# EAGLE design powerTestv1-0 (EAGLE 6.2)
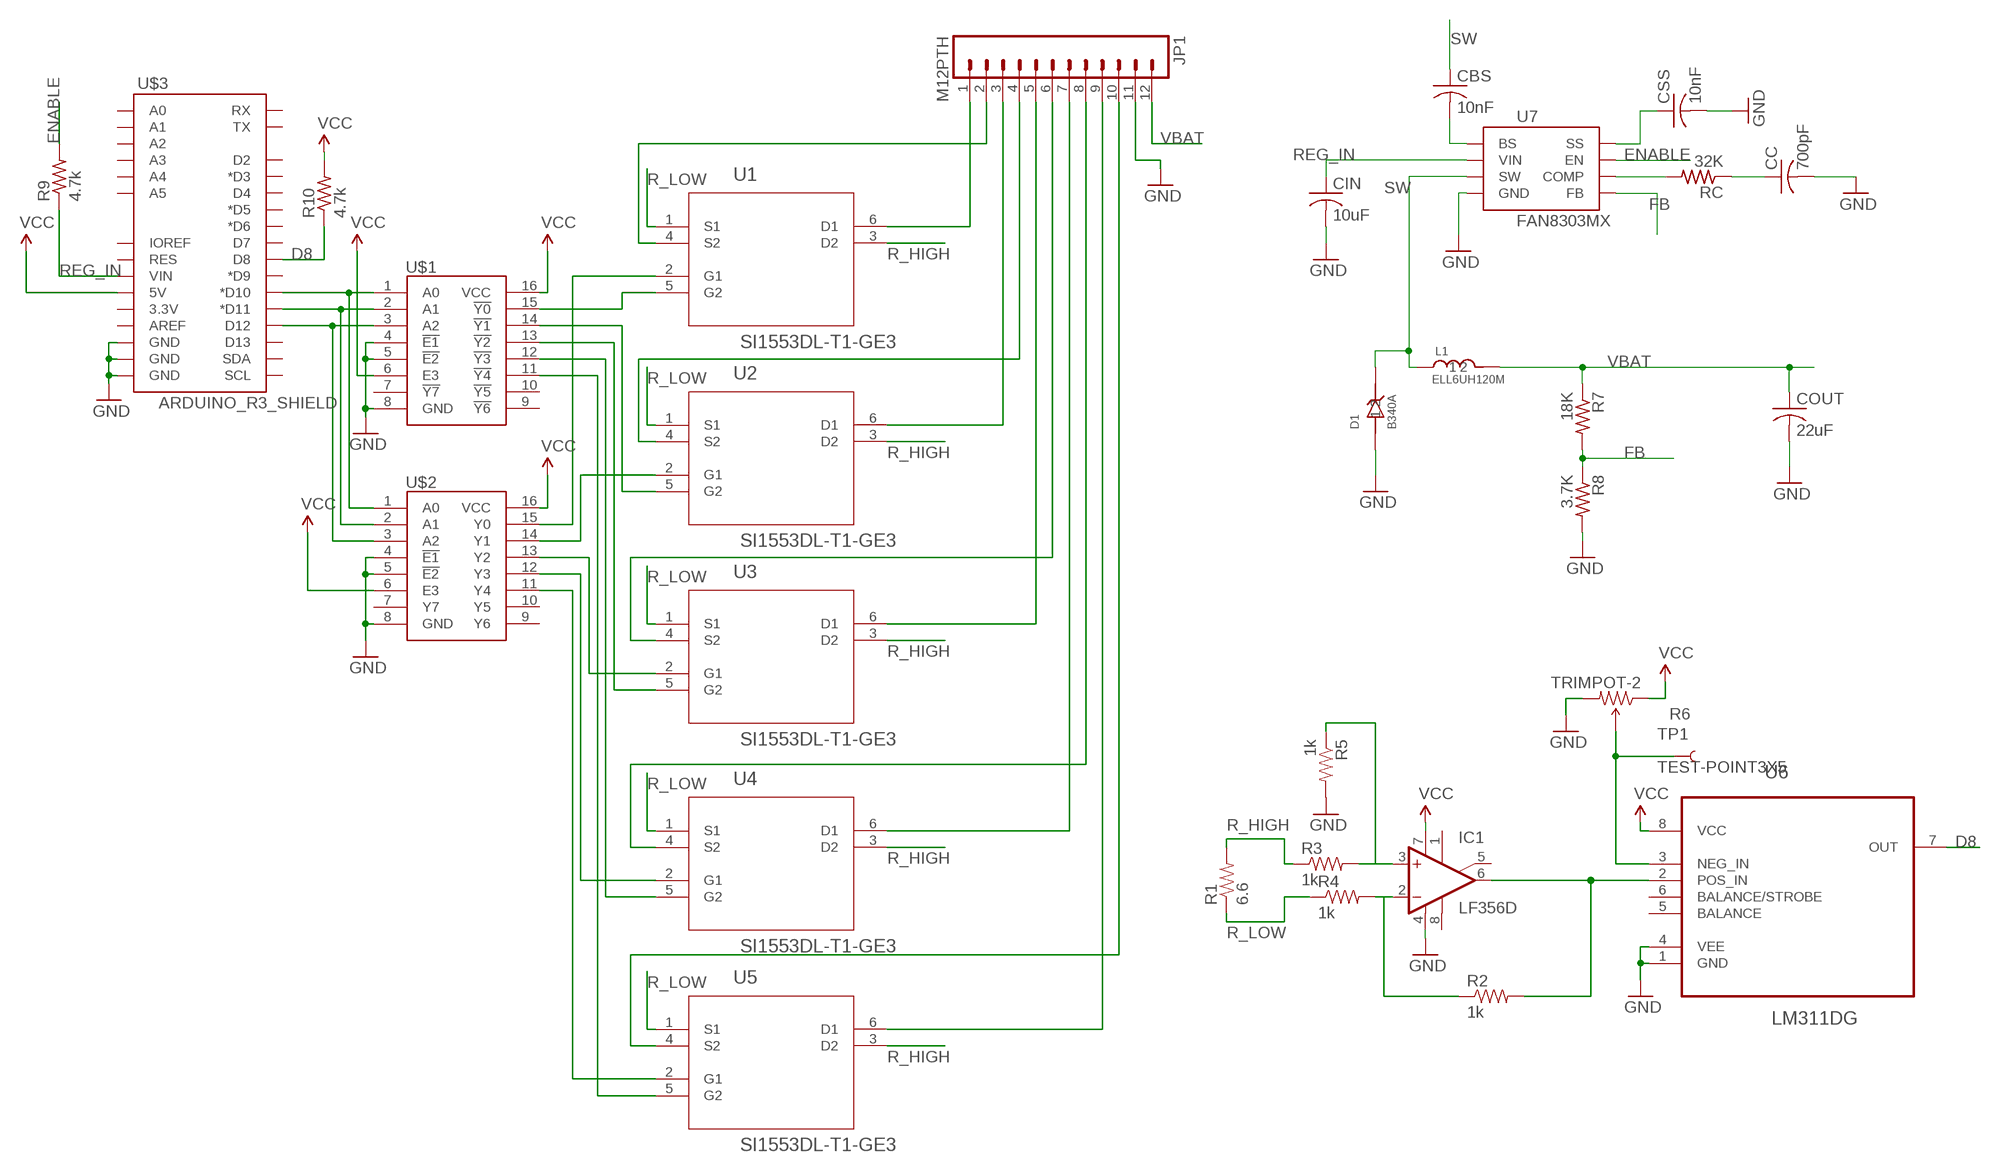
[diagram p0: schematic, sheet 1]

## Parts
CBS  10nF  C-USC0603  [C0603]
CC  700pF  C-USC0603  [C0603]
CIN  10uF  C-USC0603  [C0603]
COUT  22uF  C-USC0603  [C0603]
CSS  10nF  C-USC0603  [C0603]
D1  B340A  [B340A]
IC1  LF356D  [SO08]
JP1  M12PTH  [1X12]
L1  ELL6UH120M  [ELL6UH120M]
R1  6.6  RESISTORPTH-2W  [AXIAL-0.8]
R2  1k  RESISTOR0603-RES  [0603-RES]
R3  1k  RESISTOR0603-RES  [0603-RES]
R4  1k  RESISTOR0603-RES  [0603-RES]
R5  1k  RESISTOR0603-RES  [0603-RES]
R6  TRIMPOT-2  [TRIMPOT_TC33]
R7  18K  R-US_R0603  [R0603]
R8  3.7K  R-US_R0603  [R0603]
R9  4.7k  R-US_R0603  [R0603]
R10  4.7k  R-US_R0603  [R0603]
RC  32K  R-US_R0603  [R0603]
TP1  TEST-POINT3X5  [PAD.03X.05]
U1  SI1553DL-T1-GE3  [SOT65P210X110-6N]
U2  SI1553DL-T1-GE3  [SOT65P210X110-6N]
U3  SI1553DL-T1-GE3  [SOT65P210X110-6N]
U4  SI1553DL-T1-GE3  [SOT65P210X110-6N]
U5  SI1553DL-T1-GE3  [SOT65P210X110-6N]
U6  LM311DG  [SOIC127P600X175-8N]
U7  FAN8303MX  [FAN8303MX]
U$1  74HC138SO16  [SO16]
U$2  74HC238SO16  [SO16]
U$3  ARDUINO_R3_SHIELD  [UNO_R3_SHIELD]

## Nets
D8: R10.1 U6.7(OUT) U$3.D8
ENABLE: R9.2 U7.P$7(EN)
FB: R7.2 R8.1 U7.P$5(FB)
GND [power]: CC.2 CIN.2 COUT.2 CSS.2 D1.P$1 IC1.4(V-) JP1.11 R5.2 R6.3(CW) R8.2 U6.1(GND) U6.4(VEE) U7.P$4(GND) U$1.4(!E1) U$1.5(!E2) U$1.8(GND) U$2.4(!E1) U$2.5(!E2) U$2.8(GND) U$3.GND@0(GND) U$3.GND@1(GND) U$3.GND@2(GND)
N$1: U$1.1(A0) U$2.1(A0) U$3.D10(*D10)
N$2: U$1.2(A1) U$2.2(A1) U$3.D11(*D11)
N$3: U$1.3(A2) U$2.3(A2) U$3.D12
N$4: U1.5(G2) U$1.15(!Y0)
N$5: U2.5(G2) U$1.14(!Y1)
N$6: U3.5(G2) U$1.13(!Y2)
N$7: U4.5(G2) U$1.12(!Y3)
N$8: U5.5(G2) U$1.11(!Y4)
N$9: U1.2(G1) U$2.15(Y0)
N$10: U2.2(G1) U$2.14(Y1)
N$11: U3.2(G1) U$2.13(Y2)
N$12: U4.2(G1) U$2.12(Y3)
N$13: U5.2(G1) U$2.11(Y4)
N$14 [high_i]: JP1.1 U1.6(D1)
N$15 [high_i]: JP1.3 U2.6(D1)
N$16 [high_i]: JP1.5 U3.6(D1)
N$17 [high_i]: JP1.7 U4.6(D1)
N$18 [high_i]: JP1.9 U5.6(D1)
N$19 [high_i]: JP1.2 U1.4(S2)
N$20: IC1.2(-IN) R2.1 R4.2
N$21: IC1.6(OUT) R2.2 U6.2(POS_IN)
N$22 [high_i]: JP1.4 U2.4(S2)
N$23 [high_i]: JP1.6 U3.4(S2)
N$24 [high_i]: JP1.8 U4.4(S2)
N$25: IC1.3(+IN) R3.2 R5.1
N$26: R6.2(WIPER) TP1.P$1 U6.3(NEG_IN)
N$27: CSS.1 U7.P$8(SS)
N$28: CBS.2 U7.P$1(BS)
N$29: RC.2 U7.P$6(COMP)
N$30: CC.1 RC.1
N$31 [high_i]: JP1.10 U5.4(S2)
R_HIGH [high_i]: R1.P$2 R3.1 U1.3(D2) U2.3(D2) U3.3(D2) U4.3(D2) U5.3(D2)
R_LOW [high_i]: R1.P$1 R4.1 U1.1(S1) U2.1(S1) U3.1(S1) U4.1(S1) U5.1(S1)
REG_IN: CIN.1 R9.1 U7.P$2(VIN) U$3.VIN
SW: CBS.1 D1.P$2 L1.P$1 U7.P$3(SW)
VBAT: COUT.1 JP1.12 L1.P$2 R7.1
VCC: IC1.7(V+) R6.1(CCW) R10.2 U6.8(VCC) U$1.6(E3) U$1.16(VCC) U$2.6(E3) U$2.16(VCC) U$3.5V
Unconnected: IC1.1(ON1) IC1.5(ON2) IC1.8(OPT) U6.5(BALANCE) U6.6(BALANCE/STROBE) U$1.7(!Y7) U$1.9(!Y6) U$1.10(!Y5) U$2.7(Y7) U$2.9(Y6) U$2.10(Y5) U$3.3.3V U$3.A0 U$3.A1 U$3.A2 U$3.A3 U$3.A4 U$3.A5 U$3.AREF U$3.D2 U$3.D3(*D3) U$3.D4 U$3.D5(*D5) U$3.D6(*D6) U$3.D7 U$3.D9(*D9) U$3.D13 U$3.IOREF U$3.RES U$3.RX U$3.SCL U$3.SDA U$3.TX

## Library data of the parts
CBS CC CIN COUT CSS = rcl:C-US: CAPACITOR, American symbol
D1 = roblocks:B340A
IC1 = linear:LF356: OP AMP
JP1 = SparkFun-Connectors:M12: Header 12 Standard 12-pin 0.1" header. Use with straight break away headers (SKU : PRT-00116), right angle break away headers (PRT-00553), swiss pins (PRT-00743), machine pins (PRT-00117), and female headers (PRT-00115).
L1 = roblocks:ELL6UH120M
R1 = SparkFun-Resistors:RESISTOR: Resistor Basic schematic elements and footprints for 0603, 1206, and PTH resistors.
R2-R5 = SparkFun-Passives:RESISTOR: Resistor Basic schematic elements and footprints for 0603, 1206, and PTH resistors.
R6 = SparkFun-Electromechanical:TRIMPOT: Various small potentiometers for "set-and-forget" applications
R7-R10 RC = rcl:R-US_: RESISTOR, American symbol
TP1 = SparkFun-Passives:TEST-POINT: Bare copper test points for troubleshooting or ICT
U1-U5 = Vishay_By_element14_Batch_1:SI1553DL-T1-GE3: Complementary 2.5 V (G-S) MOSFET; MPN: SI1553DL-T1-GE3; OC_FARNELL: 2056713; OC_NEWARK: 64T4055; PACKAGE: SOT363-6; SUPPLIER: VISHAY SILICONIX
U6 = ON Semiconductor_By_element14_Batch_1:LM311DG: Single Comparators; MPN: LM311DG; OC_FARNELL: 1468705; OC_NEWARK: 98H0570; PACKAGE: SOIC-8; SUPPLIER: Onsemiconductor
U7 = roblocks:FAN8303MX
U$1 = nxp:74HC138
U$2 = nxp:74HC238
U$3 = SparkFun-Boards:ARDUINO_R3_SHIELD: Shield form compatible with the Arduino Uno R3.

## Net classes
0 signal: width 0.305 mm, drill 0.305 mm, clearance 0.152 mm
1 power: width 0.381 mm, drill 0.305 mm, clearance 0.152 mm
2 high_i: width 0.381 mm, drill 0.305 mm, clearance 0.152 mm

## Board
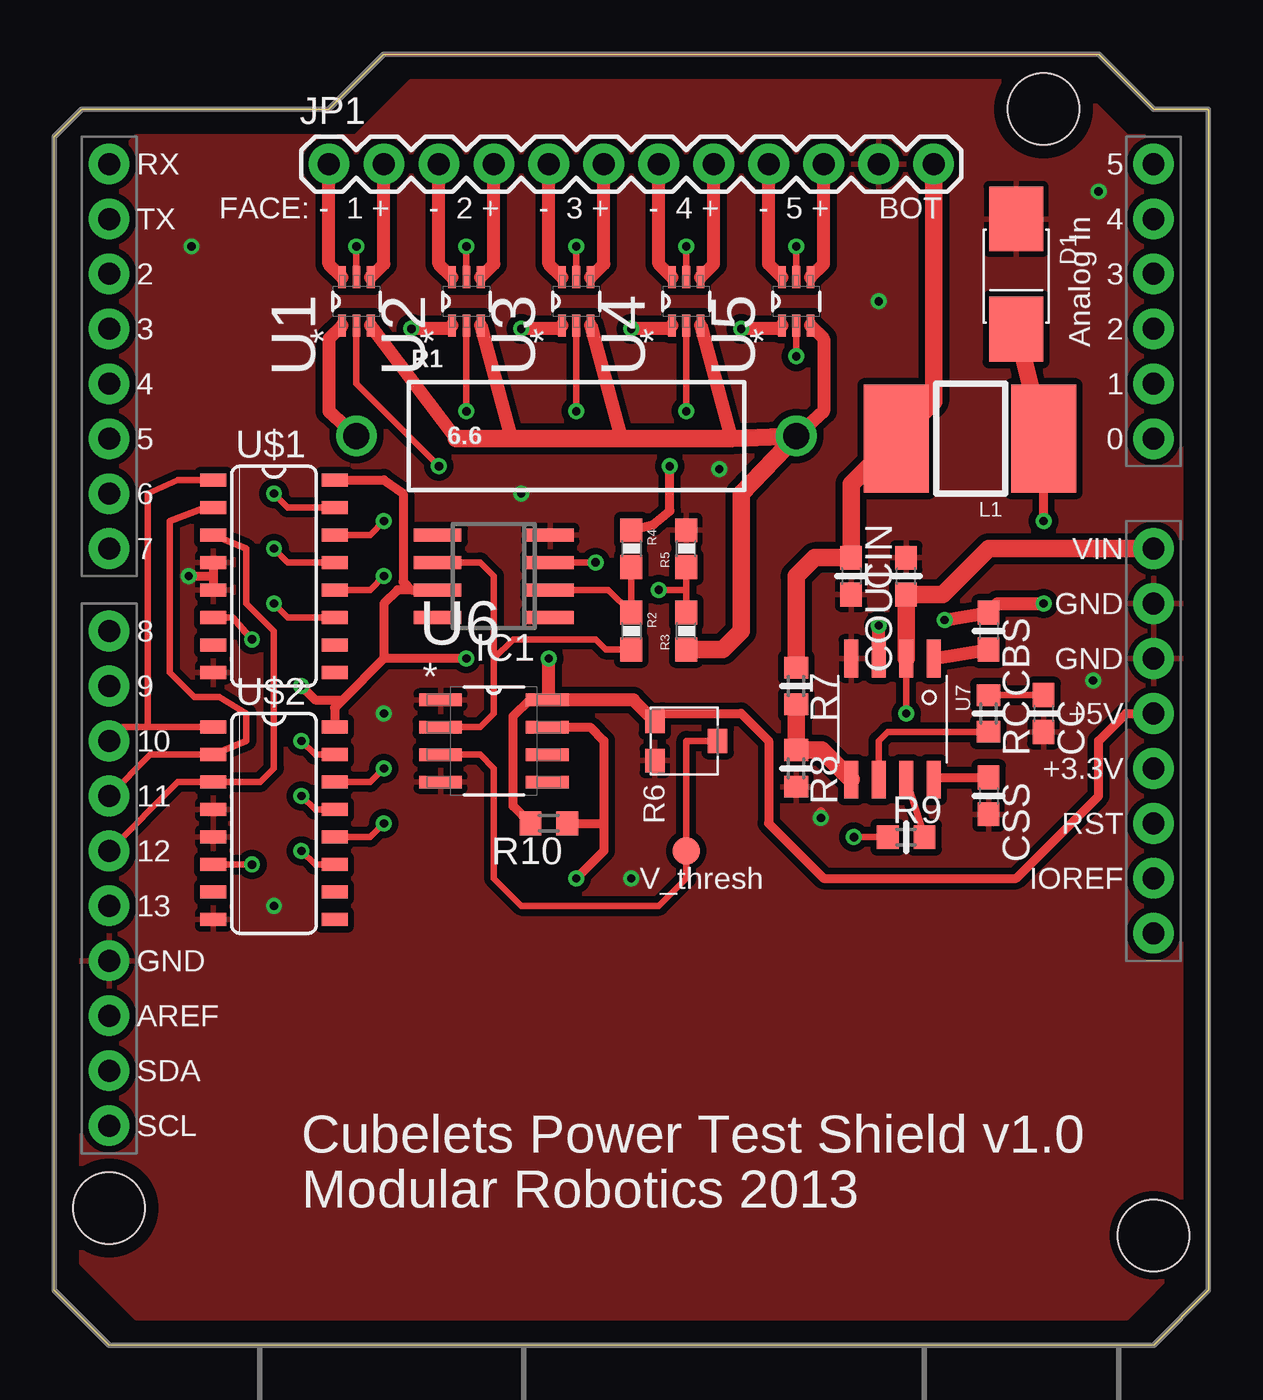
[diagram p1: board, top side]
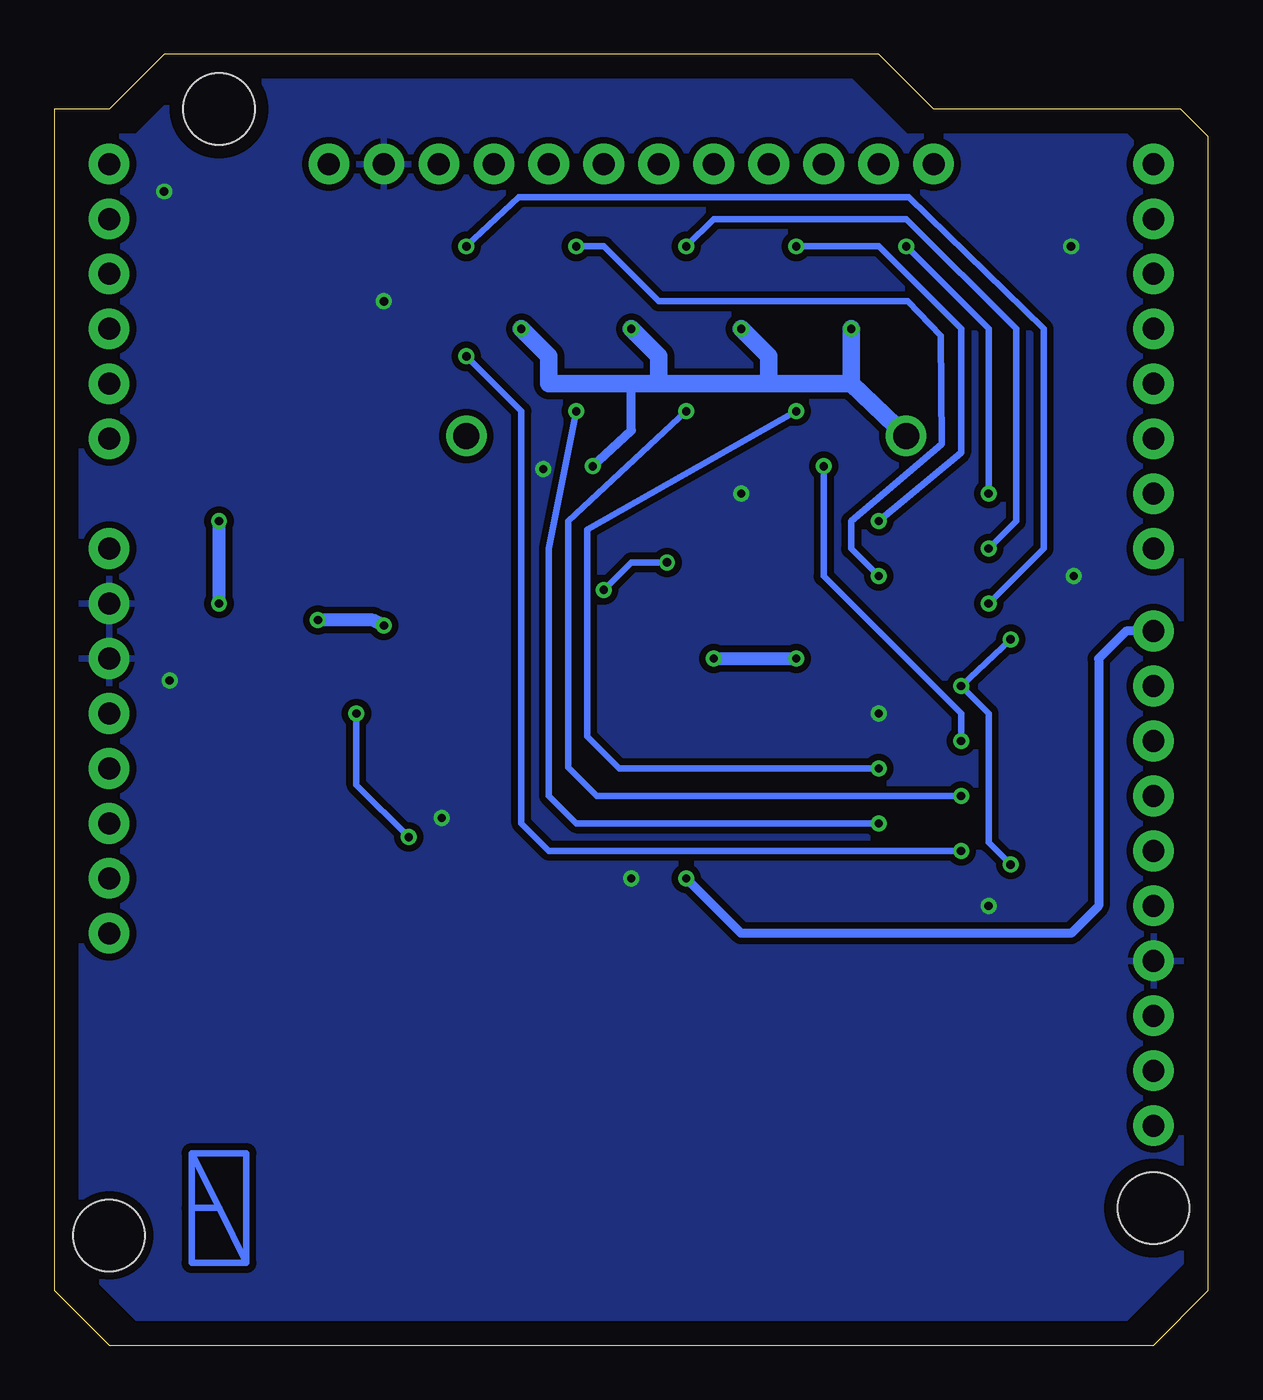
[diagram p2: board, bottom side, seen from below]

Size 53.34 x 59.69 mm. Coordinates in mm from the lower left corner, seen from the top.
Outline: 0,55.88 1.27,57.15 12.7,57.15 15.24,59.69 48.26,59.69 50.8,57.15 53.34,57.15 53.34,2.54 50.8,0 2.54,0 0,2.54 0,55.88
Copper layers (1*16): Top 0.0356mm / dielectric 1.5011mm / Bottom 0.0356mm
Design rules: minimum track width 6mil, minimum drill 13mil, track to track 6mil, track to pad 6mil, pad to pad 6mil, via to via 6mil, smd to smd 6mil, copper to edge 15mil, drill to drill 6mil, minimum pad ring 7mil, minimum via ring 7mil, stop-mask expansion 4mil, vias tented up to drill 25mil, thermal gap 10mil
Holes 3.3 mm at 45.72,57.15 2.54,6.35 50.8,5.08

### Footprints (pad centres in the part's own frame; a part is rotated, then mirrored left to right if it is on the bottom)
C0603 = smd 1.1 x 1: 1 -0.85,0; 2 0.85,0
B340A = smd 3 x 2.5: P$1 0,0; P$2 5.1,0
SO08 = smd 0.6 x 2.2: 1 -1.905,-2.6; 2 -0.635,-2.6; 3 0.635,-2.6; 4 1.905,-2.6; 5 1.905,2.6; 6 0.635,2.6; 7 -0.635,2.6; 8 -1.905,2.6
1X12 = drill 1.016 pad 1.88: 1 0,0; 2 2.54,0; 3 5.08,0; 4 7.62,0; 5 10.16,0; 6 12.7,0; 7 15.24,0; 8 17.78,0; 9 20.32,0; 10 22.86,0; 11 25.4,0; 12 27.94,0
ELL6UH120M = smd 3 x 5: P$1 0,0; P$2 6.8,0
AXIAL-0.8 = drill 1.2 pad 1.88: P$1 -10.16,0; P$2 10.16,0
0603-RES = smd 1.1 x 1: 1 -0.85,0; 2 0.85,0
TRIMPOT_TC33 = smd 1.1 x 0.9: 1 -0.91,-1.45; 2 0,1.45; 3 0.91,-1.45
R0603 = smd 1 x 1.1: 1 -0.85,0; 2 0.85,0
PAD.03X.05 = smd 1.27 x 1.27: P$1 0,0
SOT65P210X110-6N = smd 1.016 x 0.356: 1 -1.118,0.66; 2 -1.118,0; 3 -1.118,-0.66; 4 1.118,-0.66; 5 1.118,0; 6 1.118,0.66
SOIC127P600X175-8N = smd 1.981 x 0.559: 1 -2.464,1.905; 2 -2.464,0.635; 3 -2.464,-0.635; 4 -2.464,-1.905; 5 2.464,-1.905; 6 2.464,-0.635; 7 2.464,0.635; 8 2.464,1.905
FAN8303MX = smd 1.75 x 0.65: P$1 0,0; P$2 0,-1.27; P$3 0,-2.54; P$4 0,-3.81; P$5 5.6,-3.81; P$6 5.6,-2.54; P$7 5.6,-1.27; P$8 5.6,0
SO16 = smd 0.6 x 1.2: 1 -4.445,-2.8; 2 -3.175,-2.8; 3 -1.905,-2.8; 4 -0.635,-2.8; 5 0.635,-2.8; 6 1.905,-2.8; 7 3.175,-2.8; 8 4.445,-2.8; 9 4.445,2.8; 10 3.175,2.8; 11 1.905,2.8; 12 0.635,2.8; 13 -0.635,2.8; 14 -1.905,2.8; 15 -3.175,2.8; 16 -4.445,2.8
UNO_R3_SHIELD = drill 1.016 pad 1.88: 3.3V 50.8,26.67; 5V 50.8,29.21; A0 50.8,41.91; A1 50.8,44.45; A2 50.8,46.99; A3 50.8,49.53; A4 50.8,52.07; A5 50.8,54.61; AREF 2.54,15.24; D2 2.54,49.53; D3 2.54,46.99; D4 2.54,44.45; D5 2.54,41.91; D6 2.54,39.37; D7 2.54,36.83; D8 2.54,33.02; D9 2.54,30.48; D10 2.54,27.94; D11 2.54,25.4; D12 2.54,22.86; D13 2.54,20.32; GND@0 50.8,31.75; GND@1 50.8,34.29; GND@2 2.54,17.78; IOREF 50.8,21.59; NC 50.8,19.05; RES 50.8,24.13; RX 2.54,54.61; SCL 2.54,10.16; SDA 2.54,12.7; TX 2.54,52.07; VIN 50.8,36.83

### Placement (x,y rotation side)
CBS  43.18,33.02 270 top
CC  45.72,29.21 270 top
CIN  39.37,35.56 90 top
COUT  36.83,35.56 270 top
CSS  43.18,25.4 270 top
D1  44.45,52.07 270 top
IC1  20.32,35.56 90 top
JP1  12.7,54.61 0 top
L1  45.72,41.91 180 top
R1  24.13,42.04 0 top
R2  26.67,33.02 270 top
R3  29.21,33.02 90 top
R4  26.67,36.83 270 top
R5  29.21,36.83 90 top
R6  29.21,27.94 270 top
R7  34.29,30.48 270 top
R8  34.29,26.67 270 top
R9  39.37,23.5 0 top
R10  22.86,24.13 180 top
RC  43.18,29.21 270 top
TP1  29.21,22.86 0 top
U1  13.97,48.26 90 top
U2  19.05,48.26 90 top
U3  24.13,48.26 90 top
U4  29.21,48.26 90 top
U5  34.29,48.26 90 top
U6  20.32,27.94 0 top
U7  40.64,31.75 270 top
U$1  10.16,35.56 270 top
U$2  10.16,24.13 270 top
U$3  0,0 0 top

### Tracks (layer width: path | path; a pad name or v marks a point on that pad's centre or on a via)
D8  (via drill 0.38)
  Top 0.406: U6.7 24.77,28.57 25.4,27.94 25.4,24.13 | 25.4,24.13 25.4,22.86 v24.13,21.59 | R10.1 25.4,24.13
  Bottom 0.406: U$3.D8 3.81,33.02 5.08,31.75 5.08,20.32 6.35,19.05 21.59,19.05 v24.13,21.59
ENABLE
  Top 0.305: U7.P$7 R9.2
FB
  Top 0.813: R7.2 R8.1 35.46,27.52 U7.P$5
GND  (via drill 0.38)
  Top 0.406: U$1.4 7.36,35.56 | 7.36,35.56 U$1.5 | v6.22,35.56 7.36,35.56 | 35.43,24.68 v35.43,24.38
  other vias: 6.35,50.8 10.16,20.32 48.01,30.73 21.59,39.37 15.24,29.21 38.1,48.26 48.26,53.34 26.67,21.59 30.73,40.51
  pour Bottom (isolate 0.305): 1.27,3.81 3.81,1.27 49.53,1.27 52.07,3.81 52.07,55.88 49.53,55.88 46.99,58.42 16.51,58.42 13.97,55.88 3.81,55.88 1.27,53.34
  pour Top (isolate 0.305): 1.27,3.81 3.81,1.27 49.53,1.27 52.07,3.81 52.07,55.88 49.53,55.88 46.99,58.42 16.51,58.42 13.97,55.88 3.81,55.88 1.27,53.34
N$1
  Top 0.305: U$2.1 4.32,28.57 | 4.32,28.57 3.17,28.57 U$3.D10 | U$1.1 5.71,40.01 4.32,39.37 4.32,28.57
N$2
  Top 0.305: U$3.D11 4.45,27.3 U$2.2 8.89,27.94 8.89,29.21 7.62,29.97 6.47,29.97 5.33,31.11 5.33,38.1 6.99,38.73
  Top 0.406: U$1.2 6.99,38.73
N$3
  Top 0.305: U$3.D12 5.71,26.04 U$2.3 9.53,26.04 10.16,26.67 10.16,33.02 8.89,34.29 8.89,36.83 U$1.3
N$4  (via drill 0.38)
  Top 0.305: U$1.15 10.79,38.73 v10.16,39.37 | v13.97,50.8 U1.5
  Bottom 0.305: v10.16,39.37 10.16,46.99 v13.97,50.8
N$5  (via drill 0.38)
  Top 0.305: U2.5 v19.05,50.8 | v15.24,38.1 14.61,37.47 U$1.14
  Bottom 0.305: v19.05,50.8 15.24,50.8 11.43,46.99 11.43,41.27 v15.24,38.1
N$6  (via drill 0.38)
  Top 0.305: U$1.13 10.79,36.2 v10.16,36.83 | v24.13,50.8 U3.5
  Bottom 0.305: v10.16,36.83 8.89,38.1 8.89,46.99 13.97,52.07 22.86,52.07 v24.13,50.8
N$7  (via drill 0.38)
  Top 0.305: U4.5 v29.21,50.8 | v15.24,35.56 14.61,34.92 U$1.12
  Bottom 0.305: v29.21,50.8 27.94,50.8 25.4,48.26 13.9,48.26 12.38,46.68 12.32,41.66 16.51,38.1 16.51,36.83 v15.24,35.56
N$8  (via drill 0.38)
  Top 0.305: U$1.11 10.79,33.66 v10.16,34.29 | v34.29,50.8 U5.5
  Bottom 0.305: v10.16,34.29 7.62,36.83 7.62,46.99 13.84,53.09 31.88,53.09 v34.29,50.8
N$9  (via drill 0.38)
  Top 0.305: v11.43,27.94 12.06,27.3 U$2.15 | U1.2 13.97,44.45 v17.78,40.64
  Bottom 0.305: v17.78,40.64 17.78,35.56 11.43,29.21 v11.43,27.94
N$10  (via drill 0.38)
  Top 0.305: U2.2 v19.05,43.18 | v15.24,26.67 14.61,26.04 U$2.14
  Bottom 0.305: v15.24,26.67 27.22,26.67 28.7,28.15 28.7,37.72 v19.05,43.18
N$11  (via drill 0.38)
  Top 0.305: U3.2 v24.13,43.18 | v11.43,25.4 12.06,24.77 U$2.13
  Bottom 0.305: v24.13,43.18 29.59,38.1 29.59,26.73 28.27,25.4 v11.43,25.4
N$12  (via drill 0.38)
  Top 0.305: U4.2 v29.21,43.18 | v15.24,24.13 14.61,23.5 U$2.12
  Bottom 0.305: v29.21,43.18 30.48,36.83 30.48,25.4 29.21,24.13 v15.24,24.13
N$13  (via drill 0.38)
  Top 0.305: U5.2 v34.29,45.72 | v11.43,22.86 12.06,22.23 U$2.11
  Bottom 0.305: v11.43,22.86 30.48,22.86 31.75,24.13 31.75,43.18 v34.29,45.72
N$14
  Top 0.61: U1.6 12.7,49.99 JP1.1
N$15
  Top 0.61: U2.6 17.78,49.99 JP1.3
N$16
  Top 0.61: U3.6 22.86,49.99 JP1.5
N$17
  Top 0.61: U4.6 27.94,49.99 JP1.7
N$18
  Top 0.61: U5.6 33.02,49.99 JP1.9
N$19
  Top 0.61: U1.4 15.24,49.99 JP1.2
N$20
  Top 0.305: R4.2 R2.1 25.61,34.92 IC1.2
N$21
  Top 0.305: U6.2 19.68,28.57 20.32,29.21 20.32,31.75 | IC1.6 19.68,36.2 20.32,35.56 20.32,31.75 | 20.32,31.75 21.21,32.64 25.02,32.64 25.49,32.17 R2.2
N$22
  Top 0.61: U2.4 20.32,49.99 JP1.4
N$23
  Top 0.61: U3.4 25.4,49.99 JP1.6
N$24
  Top 0.61: U4.4 30.48,49.99 JP1.8
N$25  (via drill 0.38)
  Top 0.305: R5.1 29.21,34.92 | 29.21,34.92 R3.2 | IC1.3 v25.02,36.2 | v27.94,34.92 29.21,34.92
  Bottom 0.305: v25.02,36.2 26.67,36.2 v27.94,34.92
N$26
  Top 0.305: R6.2 29.21,27.94 TP1.P$1 29.21,21.59 27.94,20.32 21.59,20.32 20.32,21.59 20.32,26.67 19.68,27.3 U6.3
N$27
  Top 0.406: U7.P$8 40.74,26.25 CSS.1
N$28
  Top 0.61: U7.P$1 CBS.2
N$29
  Top 0.305: U7.P$6 38.1,27.94 38.52,28.36 RC.2
N$30
  Top 0.305: RC.1 CC.1
N$31
  Top 0.61: U5.4 35.56,49.99 JP1.10
N$33
  Bottom 0.305: 46.99,8.89 45.72,6.35 | 45.72,6.35 44.45,3.81 | 44.45,3.81 44.45,8.89 46.99,8.89 | 46.99,8.89 46.99,6.35 | 46.99,6.35 46.99,3.81 44.45,3.81 | 46.99,6.35 45.72,6.35
R_HIGH
  Top 0.61: U5.3 35.56,46.53 35.56,43.18 R1.P$2 | U2.3 21.13,41.91 | U1.3 18.59,41.91 | U3.3 26.21,41.91 | U4.3 31.29,41.91
  Top 0.813: 18.59,41.91 21.13,41.91 26.21,41.91 31.29,41.91 R1.P$2 31.75,39.37 31.75,33.02 30.9,32.17 R3.1
R_LOW  (via drill 0.38)
  Top 0.406: v28.45,40.64 28.45,38.57 27.69,37.93 R4.1
  Top 0.61: U1.1 12.7,46.53 12.7,43.18 R1.P$1 | U5.1 33.48,46.99 v31.75,46.99 | U4.1 28.4,46.99 v26.67,46.99 | U3.1 23.32,46.99 v21.59,46.99 | U2.1 18.24,46.99 v16.51,46.99
  Bottom 0.406: v28.45,40.64 26.67,42.29 26.67,44.45
  Bottom 0.813: 25.4,44.45 26.67,44.45 30.48,44.45 30.48,45.72 v31.75,46.99 | 25.4,44.45 20.32,44.45 | v26.67,46.99 25.4,45.72 25.4,44.45 | v21.59,46.99 20.32,45.72 20.32,44.45 | R1.P$1 16.51,44.45 | 16.51,44.45 20.32,44.45 | v16.51,46.99 16.51,44.45
REG_IN  (via drill 0.38)
  Top 0.305: R9.1 v36.96,23.5 | v39.37,29.21 U7.P$2
  Top 0.813: U7.P$2 CIN.1 41.06,34.71 43.18,36.83 U$3.VIN
  Bottom 0.305: v36.96,23.5 39.37,25.91 v39.37,29.21
SW  (via drill 0.38)
  Top 0.406: CBS.1 43.6,34.29 | v45.72,38.1 L1.P$1
  Top 0.61: U7.P$3 v38.1,33.27 | 43.6,34.29 v45.72,34.29 | v41.15,33.53 CBS.1
  Top 0.813: L1.P$1 D1.P$2
  Bottom 0.61: v38.1,33.27 38.61,33.53 v41.15,33.53 | v45.72,34.29 v45.72,38.1
VBAT
  Top 0.813: JP1.12 40.64,43.63 L1.P$2 36.83,39.82 COUT.1 35.14,36.41 34.29,35.56 R7.1
VCC  (via drill 0.38)
  Top 0.305: v9.14,32.64 8.26,33.66 U$1.6 | U$2.6 v9.14,22.23
  Top 0.406: R6.1 28.12,29.21 31.75,29.21 33.02,27.94 33.02,24.13 35.56,21.59 44.45,21.59 48.26,25.4 48.26,27.94 49.53,29.21 U$3.5V | 15.24,31.75 13.34,29.84 | 13.34,29.84 12.96,29.47 U$2.16 | R10.2 21.21,24.93 21.21,29.08 21.97,29.84 U6.8 | v11.43,30.48 12.06,29.84 13.34,29.84 | U$1.16 15.24,40.01 16.13,39.37 16.13,35.31 16.51,34.92 | 16.51,34.92 IC1.7 | 16.51,34.92 15.88,34.92 15.24,34.29 15.24,31.75 | v19.05,31.75 15.24,31.75
  Top 0.61: R6.1 26.77,29.84 U6.8 22.86,29.92 v22.86,31.75
  Bottom 0.305: v9.14,32.64 v11.43,30.48 10.16,29.21 10.16,23.24 v9.14,22.23
  Bottom 0.61: v22.86,31.75 v19.05,31.75

### Text on the board
tPlace: FACE: | - 1 + | - 2 + | - 3 + | - 4 + | - 5 + | BOT | V_thresh | Cubelets Power Test Shield v1.0 | Modular Robotics 2013